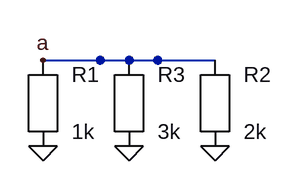
[diagram p0: schematic collinear_overlap.asc]
collinear_overlap.asc, the LTspice schematic file:
Version 4
SHEET 1 880 680
WIRE 0 96 128 96
WIRE 64 96 192 96
SYMBOL res 0 144 R0
SYMATTR InstName R1
SYMATTR Value 1k
SYMBOL res 192 144 R0
SYMATTR InstName R2
SYMATTR Value 2k
SYMBOL res 96 144 R0
SYMATTR InstName R3
SYMATTR Value 3k
FLAG 0 192 0
FLAG 192 192 0
FLAG 96 192 0
FLAG 0 96 a

The netlist it stands for:
* collinear_overlap.asc
R1 a 0 1k
R2 a 0 2k
R3 a 0 3k
.backanno
.end